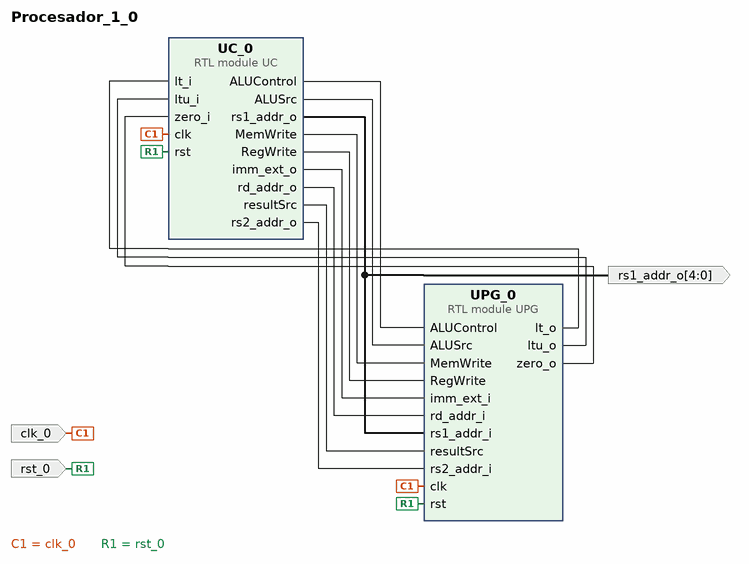
[diagram p0: block diagram of the top level]
# Vivado block design Procesador_1_0, xc7a100tcsg324-1, Vivado 2025.1
create_bd_design Procesador_1_0

create_bd_port -dir I -type clk clk_0
create_bd_port -dir I -type rst rst_0
create_bd_port -dir O -from 4 -to 0 rs1_addr_o

create_bd_cell -type module -reference UC UC_0
create_bd_cell -type module -reference UPG UPG_0

# ---- connections ----

connect_bd_net [get_bd_pins UC_0/ALUControl] [get_bd_pins UPG_0/ALUControl]
connect_bd_net [get_bd_pins UC_0/ALUSrc] [get_bd_pins UPG_0/ALUSrc]
connect_bd_net [get_bd_pins UC_0/MemWrite] [get_bd_pins UPG_0/MemWrite]
connect_bd_net [get_bd_pins UC_0/RegWrite] [get_bd_pins UPG_0/RegWrite]
connect_bd_net [get_bd_pins UC_0/imm_ext_o] [get_bd_pins UPG_0/imm_ext_i]
connect_bd_net [get_bd_pins UC_0/rd_addr_o] [get_bd_pins UPG_0/rd_addr_i]
connect_bd_net [get_bd_pins UC_0/resultSrc] [get_bd_pins UPG_0/resultSrc]
connect_bd_net [get_bd_pins UC_0/rs1_addr_o] [get_bd_ports rs1_addr_o] [get_bd_pins UPG_0/rs1_addr_i]
connect_bd_net [get_bd_pins UC_0/rs2_addr_o] [get_bd_pins UPG_0/rs2_addr_i]
connect_bd_net [get_bd_pins UPG_0/lt_o] [get_bd_pins UC_0/lt_i]
connect_bd_net [get_bd_pins UPG_0/ltu_o] [get_bd_pins UC_0/ltu_i]
connect_bd_net [get_bd_pins UPG_0/zero_o] [get_bd_pins UC_0/zero_i]
connect_bd_net -net clk_0_1 [get_bd_ports clk_0] [get_bd_pins UC_0/clk] [get_bd_pins UPG_0/clk]
connect_bd_net -net rst_0_1 [get_bd_ports rst_0] [get_bd_pins UC_0/rst] [get_bd_pins UPG_0/rst]

validate_bd_design
save_bd_design
